# EAGLE design tiny (EAGLE 7.1.0)
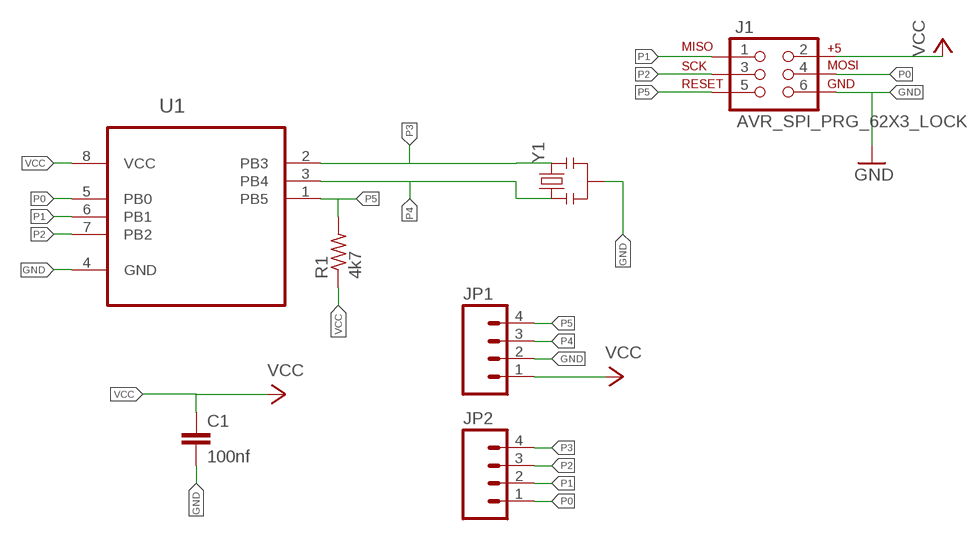
[diagram p0: schematic, sheet 1]

## Parts
C1  100nf  C-EU025-024X044  [C025-024X044]
J1  AVR_SPI_PRG_62X3_LOCK  [2X3_LOCK]
JP1  M04LOCK  [1X04_LOCK]
JP2  M04LOCK  [1X04_LOCK]
R1  4k7  R-US_0207/12  [0207/12]
U1  ATTINY25V-10PU  [DIP254P762X533-8]
Y1  RESONATORPTH  [RESONATOR-PTH]

## Nets
GND: C1.2 J1.6 JP1.2 U1.4(GND) Y1.2
P0: J1.4 JP2.1 U1.5(PB0)
P1: J1.1 JP2.2 U1.6(PB1)
P2: J1.3 JP2.3 U1.7(PB2)
P3: JP2.4 U1.2(PB3) Y1.3
P4: JP1.3 U1.3(PB4) Y1.1
P5: J1.5 JP1.4 R1.2 U1.1(PB5)
VCC: C1.1 J1.2 JP1.1 R1.1 U1.8(VCC)

## Library data of the parts
C1 = rcl:C-EU: CAPACITOR, European symbol
J1 = SparkFun-Connectors:AVR_SPI_PRG_6: AVR ISP 6 Pin This is the reduced ISP connector for AVR programming. Common on Arduino. This footprint will take up less PCB space and can be used with a 10-pin to 6-pin adapter such as SKU: BOB-08508 **Special note about "TEST_POINT" package. The stop mask is on the top side, so if you want your programming test points to be on the bottom of your board, make sure to place this package on the bottom side of the board. This also ensure that the orientation to program from the bottom side will be correct.
JP1 JP2 = SparkFun-Connectors:M04: Header 4 Standard 4-pin 0.1" header. Use with straight break away headers (SKU : PRT-00116), right angle break away headers (PRT-00553), swiss pins (PRT-00743), machine pins (PRT-00117), and female headers (PRT-00115). Molex polarized connector foot print use with SKU : PRT-08231 with associated crimp pins and housings. 1MM SMD Version SKU: PRT-10208
R1 = resistor:R-US_: RESISTOR, American symbol
U1 = Atmel_By_element14_Batch_1-00:ATTINY25V-10PU: 8-bit Microcontroller with 2/4/8KBytes In-System Programmable Flash; MPN: ATTINY25V-10PU; OC_FARNELL: 1455144; OC_NEWARK: 58M3780; PACKAGE: PDIP-8; SUPPLIER: Atmel
Y1 = SparkFun-FreqCtrl:RESONATOR: Resonator Small SMD resonator. Used, eg, on the Arduino Pro/ Pro Mini boards. 8MHz- XTAL-08895 16MHz- XTAL-08900

## Board
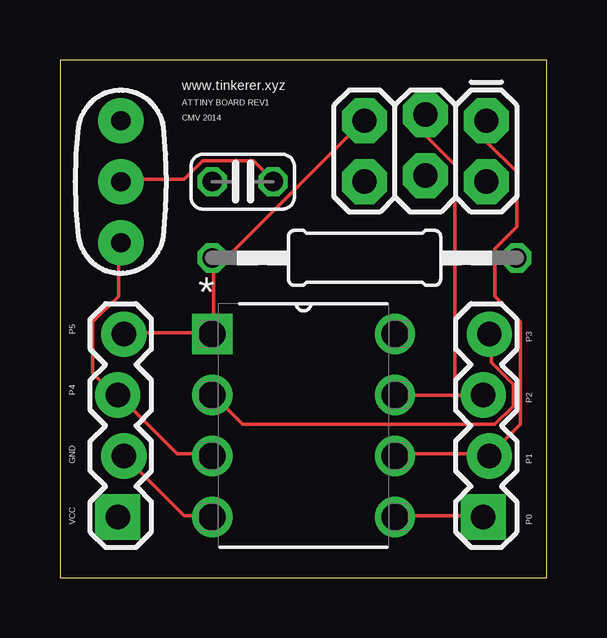
[diagram p1: board, top side]
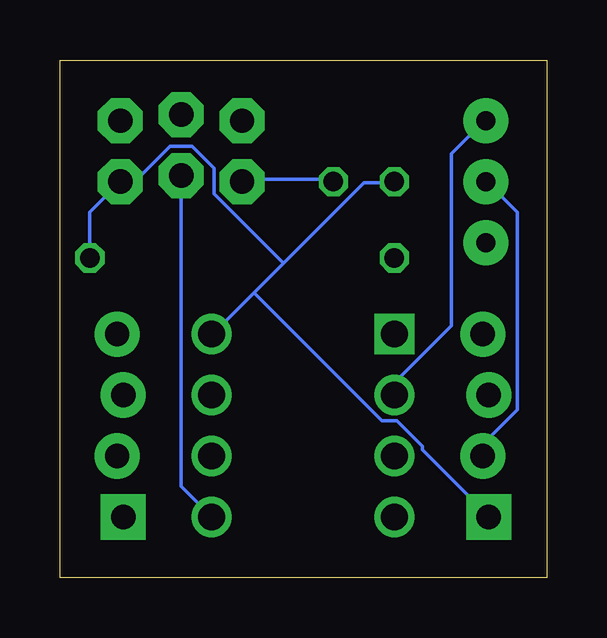
[diagram p2: board, bottom side, seen from below]

Size 20.29 x 21.58 mm. Coordinates in mm from the lower left corner, seen from the top.
Outline: 0,0 20.3,0 20.3,21.58 0,21.58 0,0
Copper layers (1*16): Top 0.0356mm / dielectric 1.5011mm / Bottom 0.0356mm
Design rules "LaenPCBOrder": minimum track width 6mil, minimum drill 13mil, track to track 6mil, track to pad 6mil, pad to pad 6mil, via to via 6mil, smd to smd 6mil, copper to edge 15mil, drill to drill 6mil, minimum pad ring 7mil, minimum via ring 7mil, stop-mask expansion 3mil, vias tented up to drill 0mil, thermal gap 10mil

### Footprints (pad centres in the part's own frame; a part is rotated, then mirrored left to right if it is on the bottom)
C025-024X044 = drill 0.813 octagon: 1 -1.27,0; 2 1.27,0
2X3_LOCK = drill 1.016 pad 1.88 octagon: 1 0,0; 2 0,2.54; 3 2.54,-0.254; 4 2.54,2.286; 5 5.08,0; 6 5.08,2.54
1X04_LOCK = drill 1.016 pad 1.88 square: 1 0,0.127 | drill 1.016 pad 1.88: 2 2.54,-0.127; 3 5.08,0.127; 4 7.62,-0.127
0207/12 = drill 0.813 octagon: 1 -6.35,0; 2 6.35,0
DIP254P762X533-8 = drill 1.118 square: 1 -7.62,7.62 | drill 1.118: 2 -7.62,5.08; 3 -7.62,2.54; 4 -7.62,0; 5 0,0; 6 0,2.54; 7 0,5.08; 8 0,7.62
RESONATOR-PTH = drill 0.8 pad 1.88: 1 -2.54,0; 2 0,0; 3 2.54,0

### Placement (x,y rotation side)
C1  7.62,16.51 0 top
J1  17.78,19.05 180 top
JP1  2.54,2.54 90 top
JP2  17.78,2.54 90 top
R1  12.7,13.34 180 top
U1  13.97,2.54 0 top
Y1  2.54,16.51 90 top

### Tracks (layer width: path | path; a pad name or v marks a point on that pad's centre or on a via)
GND
  Top 0.152: U1.4 6.25,2.59 5.18,2.59 2.74,5.03 JP1.2 | Y1.2 2.59,16.61 5.18,16.61 5.94,17.37 8.08,17.37 8.84,16.61 C1.2
  Bottom 0.152: C1.2 8.99,16.61 12.65,16.61 J1.6 | JP1.2 2.59,5.18 2.59,5.64 1.22,7.01 1.22,15.24 2.44,16.46 Y1.2
P0
  Top 0.152: U1.5 14.02,2.59 17.53,2.59 JP2.1
  Bottom 0.152: J1.4 15.24,3.81 U1.5
P1
  Top 0.152: U1.6 14.02,5.18 17.83,5.18 JP2.2 17.98,5.18 19.2,6.4 19.2,10.67 18.14,11.73 18.14,13.72 19.05,14.63 19.05,16.92 17.83,18.14 17.83,19.05 J1.1
P2
  Top 0.152: JP2.3 16.46,7.62 | 16.46,7.62 U1.7 | J1.3 15.24,18.44 16.46,17.22 16.46,7.62
P3
  Top 0.152: JP2.4 17.98,10.06 17.98,8.99 18.9,8.08 18.9,7.16 18.14,6.4 7.62,6.4 6.4,7.62 U1.2
  Bottom 0.152: U1.2 6.25,7.62 6.25,8.23 3.96,10.52 3.96,17.68 2.59,19.05 Y1.3
P4
  Top 0.152: U1.3 6.25,5.18 4.88,5.18 2.44,7.62 JP1.3 2.29,7.62 1.37,8.53 1.37,10.67 2.44,11.73 2.44,13.87 Y1.1
P5
  Top 0.152: JP1.4 2.74,10.21 6.25,10.21 U1.1 6.4,10.21 6.4,13.26 R1.2 6.4,13.41 7.01,13.41 12.65,19.05 J1.5
VCC
  Bottom 0.152: R1.1 19.05,15.24 J1.2 17.68,16.61 17.07,16.61 15.7,17.98 14.78,17.98 13.87,17.07 13.87,16 10.97,13.11 | 12.19,11.89 13.87,10.21 U1.8 | 12.19,11.89 10.97,13.11 | 10.97,13.11 7.62,16.46 6.4,16.46 C1.1 | 12.19,11.89 6.86,6.55 6.25,6.55 5.18,5.49 5.18,5.33 2.44,2.59 JP1.1

### Text on the board
tPlace: ATTINY BOARD REV1 | www.tinkerer.xyz | CMV 2014 | P5 | P3 | P4 | P2 | GND | P1 | VCC | P0